# Altium schematic sheet Sheet_REMOTE CONTROL IR.SchDoc
size A4; Organization: Altium Limited; Address1: L3, 12a Rodborough Rd; Address2: Frenchs Forest; Address3: NSW; Address4: Australia 2086
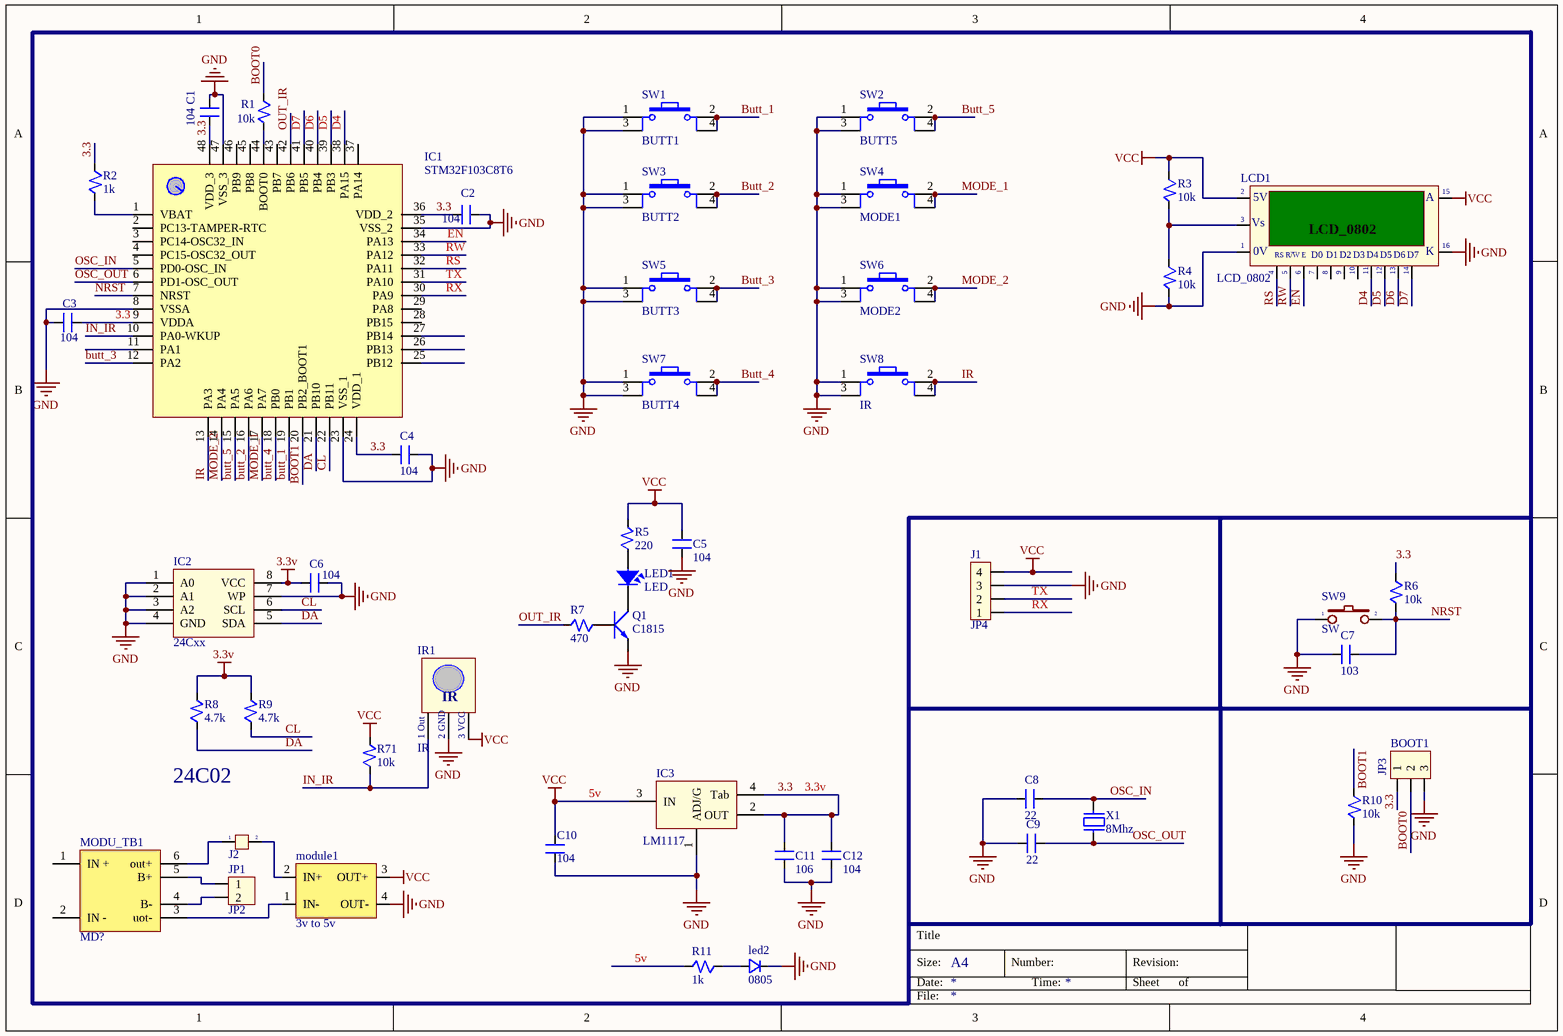
[diagram p0: Sheet_REMOTE CONTROL IR.SchDoc]

## Parts
BOOT1  JP3  [CON3]
C1  104  [SM-0805]
C2  104  [SM-0805]
C3  104  [SM-0805]
C4  104  [SM-0805]
C5  104  [SM-0805]
C6  104  [SM-0805]
C7  103  [SM-0805]
C8  22  [SM-0805]
C9  22  [SM-0805]
C10  104  [SM-0805]
C11  106  [SM-0805]
C12  104  [SM-0805]
IC1  STM32F103C8T6  [STM32F103C8T6]
IC2  24Cxx  [SOP8]
IC3  LM1117  [SOT223-4N]
IR1  IR  [IR]
J1  JP4  [jp4]
J2  Jumper 2  [JP2]  (value not drawn)
JP1  JP2  [CON2]
LCD1  LCD_0802  [LCD0802]
LED1  LED  [led5mm_yellow]
led2  0805  [0805]
MODU_TB1  MD?  [MODU_Tb4056]
module1  3v to 5v  [3v to 5v]
Q1  C1815  [SOT23B]
R1  10k  [RES_0805]
R2  1k  [RES_0805]
R3  10k  [RES_0805]
R4  10k  [RES_0805]
R5  220  [RES_0805]
R6  10k  [RES_0805]
R7  470  [RES_0805]
R8  4.7k  [RES_0805]
R9  4.7k  [RES_0805]
R10  10k  [RES_0805]
R11  1k  [RES_0805]
R71  10k  [RES_0805]
SW1  BUTT1  [SW4]
SW2  BUTT5  [SW4]
SW3  BUTT2  [SW4]
SW4  MODE1  [SW4]
SW5  BUTT3  [SW4]
SW6  MODE2  [SW4]
SW7  BUTT4  [SW4]
SW8  IR  [SW4]
SW9  SW  [SW2]
X1  8Mhz  [XT2]

## Nets
3.3: BOOT1.1 C1.2 C2.2 C3.2 C4.1 C6.2 C11.2 C12.2 IC1.9(VDDA) IC1.24(VDD_1) IC1.36(VDD_2) IC1.48(VDD_3) IC2.8(VCC) IC3.2(OUT) IC3.4(Tab) R2.1 R6.1 R8.2 R9.2  [also labelled 3.3v]
5v: C5.2 C10.2 IC3.3(IN) IR1.3(VCC) J1.4 LCD1.2(VDD) LCD1.15(A) module1.3(OUT+) R3.1 R5.2 R11.2 R71.2  [also labelled VCC]
GND: BOOT1.3 C1.1 C2.1 C3.1 C4.2 C5.1 C6.1 C7.1 C8.1 C9.1 C10.1 C11.1 C12.1 IC1.8(VSSA) IC1.23(VSS_1) IC1.35(VSS_2) IC1.47(VSS_3) IC2.1(A0) IC2.2(A1) IC2.3(A2) IC2.4(GND) IC2.7(WP) IC3.1(ADJ/G) IR1.2(GND) J1.3 LCD1.1(GND) LCD1.16(K) led2.2 module1.4(OUT-) Q1.1(E) R4.2 R10.2 SW1.1 SW1.3 SW2.1 SW2.3 SW3.1 SW3.3 SW4.1 SW4.3 SW5.1 SW5.3 SW6.1 SW6.3 SW7.1 SW7.3 SW8.1 SW8.3 SW9.1
BOOT0: BOOT1.2 R1.1
BOOT1: IC1.20(PB2_BOOT1) R10.1
Butt_1: IC1.19(PB1) SW1.2 SW1.4
Butt_2: IC1.16(PA6) SW3.2 SW3.4
Butt_3: IC1.12(PA2) SW5.2 SW5.4
Butt_4: IC1.18(PB0) SW7.2 SW7.4
Butt_5: IC1.15(PA5) SW2.2 SW2.4
CL: IC1.22(PB11) IC2.6(SCL) R9.1
D4: IC1.38(PA15) LCD1.11(D4)
D5: IC1.39(PB3) LCD1.12(D5)
D6: IC1.40(PB4) LCD1.13(D6)
D7: IC1.41(PB5) LCD1.14(D7)
DA: IC1.21(PB10) IC2.5(SDA) R8.1
EN: IC1.34(PA13) LCD1.6(~{EN})
IN_IR: IC1.10(PA0-WKUP) IR1.1(Out) R71.1
IR: IC1.13(PA3) SW8.2 SW8.4
MODE_1: IC1.17(PA7) SW4.2 SW4.4
MODE_2: IC1.14(PA4) SW6.2 SW6.4
NRST: C7.2 IC1.7(NRST) R6.2 SW9.2
OSC_IN: C8.2 IC1.5(PD0-OSC_IN) X1.2
OSC_OUT: C9.2 IC1.6(PD1-OSC_OUT) X1.1
OUT_IR: IC1.42(PB6) R7.2
RS: IC1.32(PA11) LCD1.4(RS)
RW: IC1.33(PA12) LCD1.5(R/~{W})
RX: IC1.30(PA9) J1.1
TX: IC1.31(PA10) J1.2
NetIC1_1: IC1.1(VBAT) R2.2
NetIC1_44: IC1.44(BOOT0) R1.2
NetJ2_1: J2.1 MODU_TB1.6(out+)
NetJ2_2: J2.2 module1.2(IN+)
NetJP1_1: JP1.1 MODU_TB1.5(B+)
NetJP1_2: JP1.2 MODU_TB1.4(B-)
NetLCD1_3: LCD1.3(VEE) R3.2 R4.1
NetLED1_1: LED1.1 R5.1
NetLED1_2: LED1.2 Q1.2(C)
Netled2_1: led2.1 R11.1
NetMODU_TB1_3: MODU_TB1.3(uot-) module1.1(IN-)
NetQ1_3: Q1.3(B) R7.1

Not connected (* = marked no-connect by the designer): IC1 2(PC13-TAMPER-RTC) 3(PC14-OSC32_IN) 4(PC15-OSC32_OUT) 11(PA1) 25(PB12) 26(PB13) 27(PB14) 28(PB15) 29(PA8) 37(PA14) 43(PB7) 45(PB8) 46(PB9); LCD1 7(D0) 8(D1) 9(D2) 10(D3); MODU_TB1 1(IN_+) 2(IN_-)

## Notes on the sheet
- 24C02
- Title
- Size:
- Date:
- A4
- Number:
- Time:
- Revision:
- Sheet
- of
- File:
- (in symbol IR) 1 Out; 2 GND; 3 VCC
- (in symbol LCD_0802) 5V; Vs; |; 0V; R/W; E

## Library data of the parts
BOOT1 = Con3: Connector 3; Value: Connector 3
C1-C6 C8-C12 = CM: Cap SMD; Value: 103
C7 = CM: Cap SMD; Value: 103
IC2 = 24Cxx: Standard 2-Wire Bus Interface Serial EEPROM; Value: DIP 8; Value: 24Cxx; Copyright by: VanDungEvn
IC3 = LM1117: 3v3; Value: LM317
IR1 = IR: Receiver Infraed IC
J2 = JP 2: Value: JP 2
JP1 = Con2: Connector 2; Value: Connector 2
LED1 = LED: LED Single colour Green and Red; Value: LED 3 ly Single Colour; Description: LED 5 ly Single Colour; Description: Led  Vuong
led2 = led_dan
MODU_TB1 = TB4056: Modu_nguon
Q1 = C1815: NPN 600mW, ECB; Value: C1815
R1-R11 R71 = RES_0805: res_dan
SW1-SW8 = SW4: Switch button 4 pin; Value: Button chip 4 pin
SW9 = SW2: Switch button 2 pin; Value: SW chip 2 pin
X1 = XT2: Crystal For all Crystal 2pin.; Value: 4Mhz